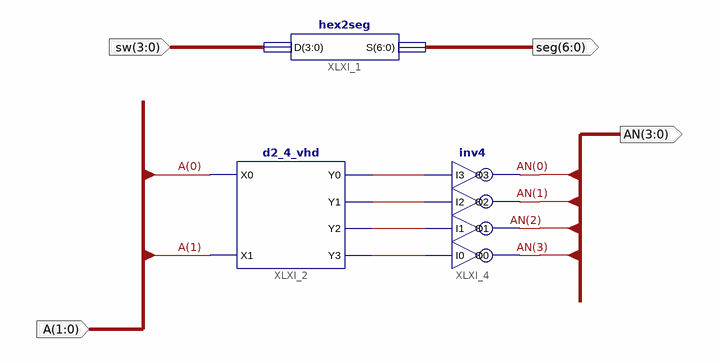
[diagram p0: schematic sheet 1]
// Xilinx ISE schematic main.sch (spartan6) as structural Verilog: 3 symbols, 4 ports
module main (
  input  [3:0] sw,
  input  [1:0] A,
  output [6:0] seg,
  output [3:0] AN
);

  wire XLXN_13, XLXN_14, XLXN_15, XLXN_16;

  hex2seg XLXI_1 (.D(sw), .S(seg));
  d2_4_vhd XLXI_2 (.X0(A[0]), .X1(A[1]), .Y0(XLXN_13), .Y1(XLXN_14), .Y2(XLXN_15), .Y3(XLXN_16));
  inv4 XLXI_4 (.I0(XLXN_16), .I1(XLXN_15), .I2(XLXN_14), .I3(XLXN_13), .O0(AN[3]), .O1(AN[2]), .O2(AN[1]), .O3(AN[0]));
endmodule
